# Altium schematic sheet 12 uart.SchDoc
size A3; SheetNumber: 16; SheetTotal: 16
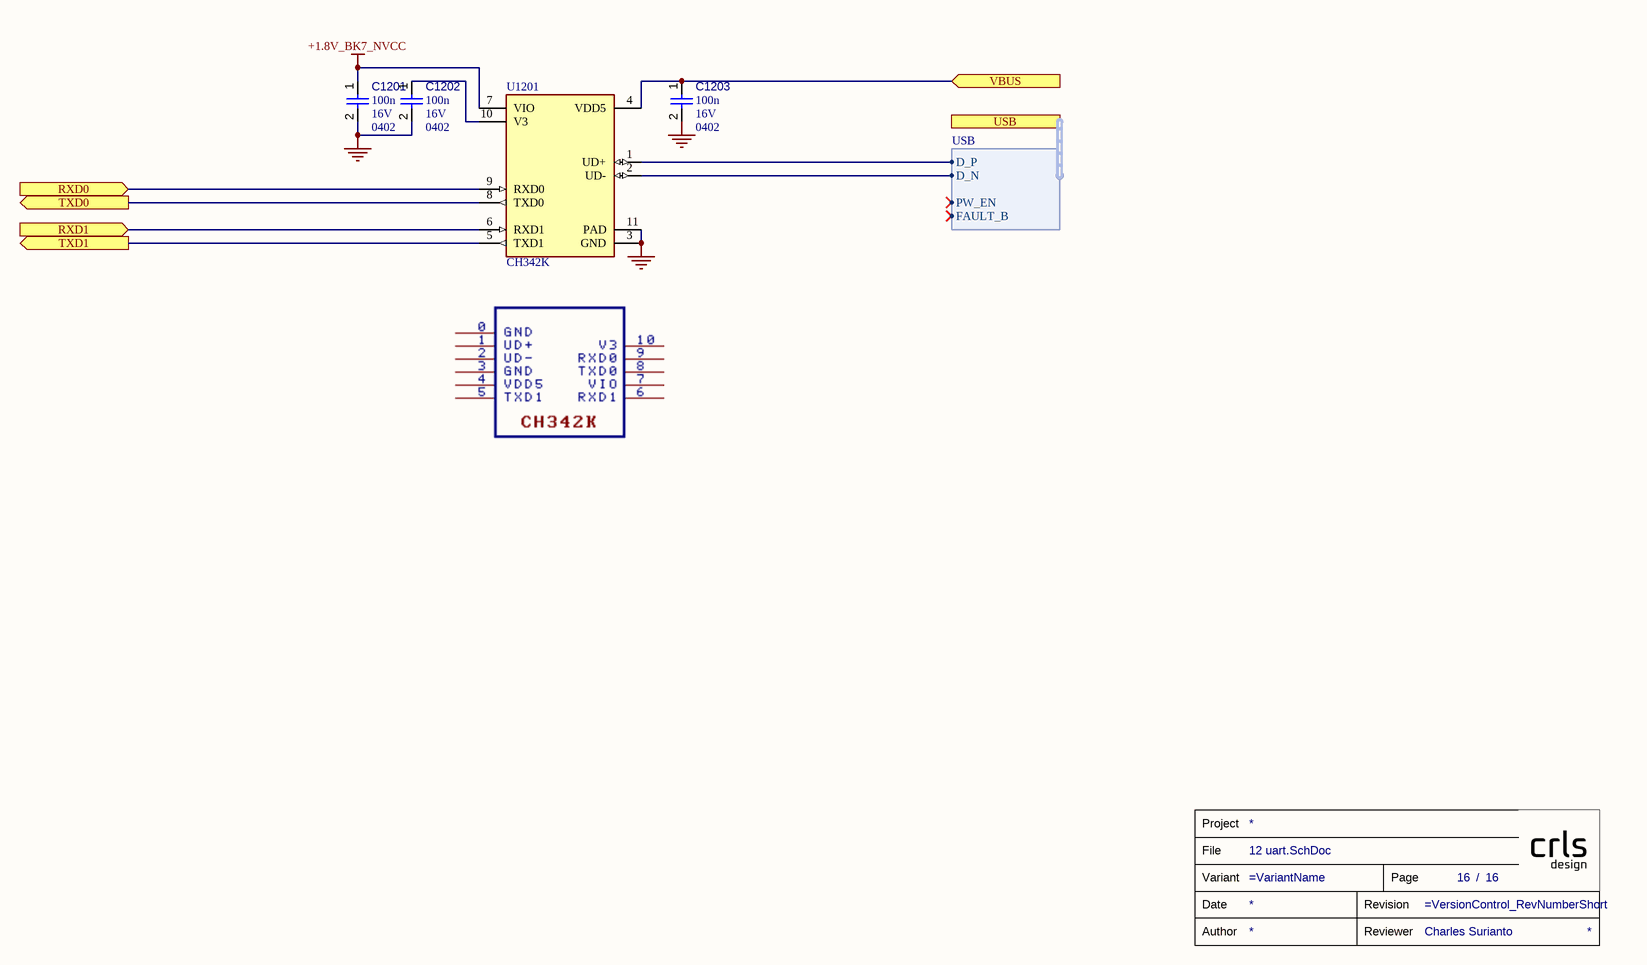
[diagram p0: 12 uart.SchDoc]

## Parts
C1201  value 100n  Case/Package: 0402  Voltage Rating: 16V  [CAPC0402(1005)60_L]  (hidden comment: Capacitors,0402,100n,16V)
C1202  value 100n  Case/Package: 0402  Voltage Rating: 16V  [CAPC0402(1005)60_L]  (hidden comment: Capacitors,0402,100n,16V)
C1203  value 100n  Case/Package: 0402  Voltage Rating: 16V  [CAPC0402(1005)60_L]  (hidden comment: Capacitors,0402,100n,16V)
TB?  Reviewer: Charles Surianto  (hidden comment: TITLE_BLOCK)  (graphical)
U1201  CH342K  [ESSOP-10_L4.9-W3.9-P1.0-LS6.0-TL-EP]

## Ports
RXD0 (in), RXD1 (in), TXD0 (out), TXD1 (out), USB (harness USB), VBUS (in)

## Harnesses
USB: D_P, D_N, PW_EN, FAULT_B

## Nets
+1.8V_BK7_NVCC: C1201.1 U1201.7(VIO)
GND: C1201.2 C1202.2 C1203.2 U1201.3(GND) U1201.11(PAD)
RXD0: U1201.9(RXD0) ; port RXD0
RXD1: U1201.6(RXD1) ; port RXD1
TXD0: U1201.8(TXD0) ; port TXD0
TXD1: U1201.5(TXD1) ; port TXD1
VBUS: C1203.1 U1201.4(VDD5) ; port VBUS
NetC1202_1: C1202.1 U1201.10(V3)
NetU1201_1: U1201.1(UD+) ; port USB.D_P
NetU1201_2: U1201.2(UD-) ; port USB.D_N

## Notes on the sheet
- (in symbol TITLE_BLOCK) Project; File; Variant; Page; /; Date; Revision; Author; Reviewer

## Library data of the parts
C1201-C1203 = Capacitors: Capacitor; Component Type: Capacitors
U1201 = CH342K: ESSOP-10-150mil USB Converters ROHS
TB? = TITLE_BLOCK: Review Date: *